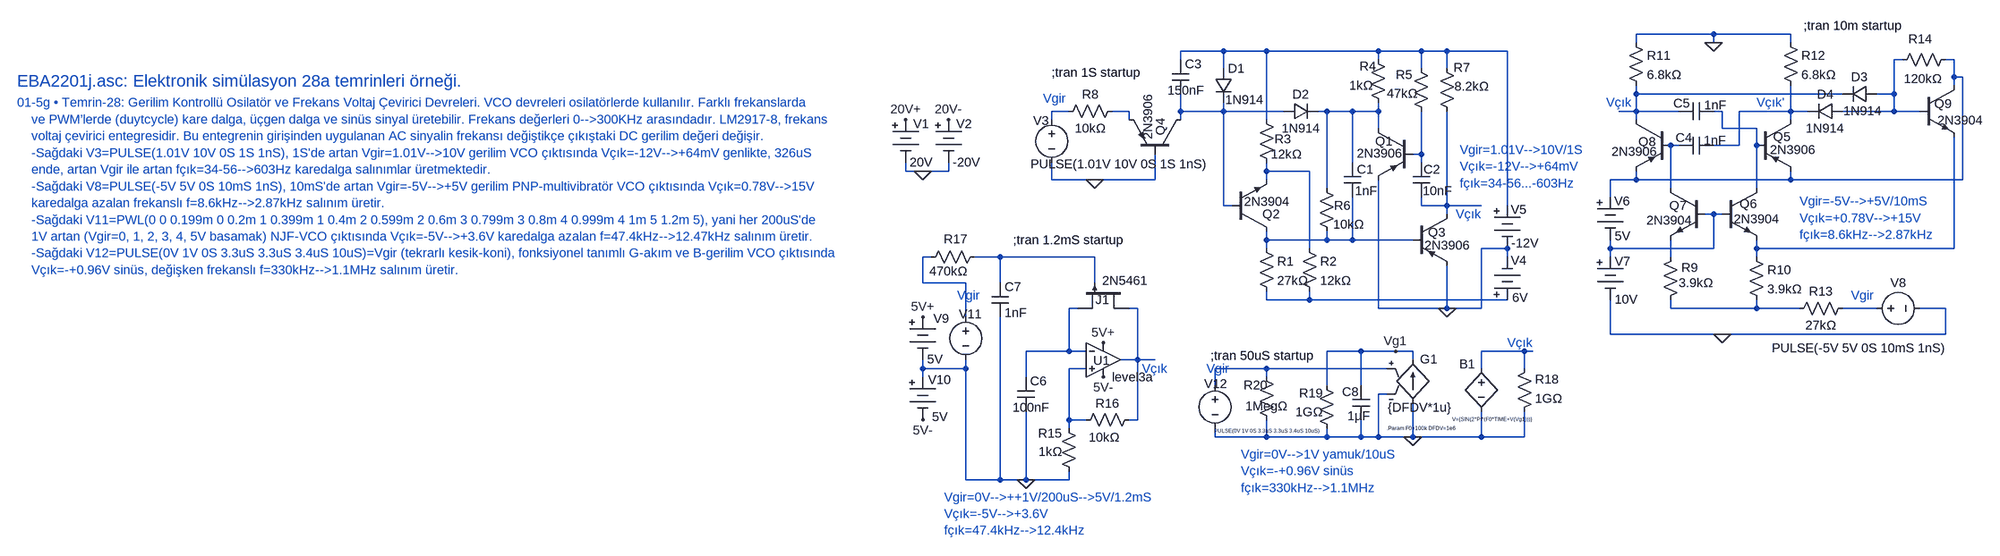
[diagram p0: schematic EBA2201j.asc]
EBA2201j.asc, the LTspice schematic file:
Version 4
SHEET 1 7064 4332
WIRE 3136 -32 2992 -32
WIRE 3280 -32 3136 -32
WIRE 2992 -16 2992 -32
WIRE 3136 -16 3136 -32
WIRE 3280 -16 3280 -32
WIRE 2224 0 2144 0
WIRE 2304 0 2224 0
WIRE 2512 0 2304 0
WIRE 2592 0 2512 0
WIRE 2640 0 2592 0
WIRE 2752 0 2640 0
WIRE 2144 16 2144 0
WIRE 2512 16 2512 0
WIRE 3488 16 3472 16
WIRE 3584 16 3568 16
WIRE 2224 32 2224 0
WIRE 2592 32 2592 0
WIRE 2640 32 2640 0
WIRE 3584 48 3584 16
WIRE 3600 48 3584 48
WIRE 3584 64 3584 48
WIRE 2992 80 2992 64
WIRE 3376 80 2992 80
WIRE 3472 80 3472 16
WIRE 3472 80 3440 80
WIRE 1936 112 1904 112
WIRE 2048 112 2016 112
WIRE 2144 112 2144 80
WIRE 2224 112 2224 96
WIRE 2224 112 2144 112
WIRE 2336 112 2224 112
WIRE 2416 112 2400 112
WIRE 2464 112 2416 112
WIRE 2512 112 2512 96
WIRE 2512 112 2464 112
WIRE 2992 112 2992 80
WIRE 2992 112 2960 112
WIRE 3072 112 2992 112
WIRE 3152 112 3136 112
WIRE 3280 112 3280 64
WIRE 3280 112 3184 112
WIRE 3312 112 3280 112
WIRE 3472 112 3472 80
WIRE 3472 112 3376 112
WIRE 3520 112 3472 112
WIRE 1904 128 1904 112
WIRE 2048 128 2048 112
WIRE 2144 128 2144 112
WIRE 2304 128 2304 0
WIRE 2992 128 2992 112
WIRE 3280 128 3280 112
WIRE 2512 144 2512 112
WIRE 3152 144 3152 112
WIRE 3216 144 3152 144
WIRE 3072 176 3056 176
WIRE 3184 176 3184 112
WIRE 3184 176 3136 176
WIRE 3216 176 3216 144
WIRE 2592 192 2592 112
WIRE 2592 192 2576 192
WIRE 2464 208 2464 112
WIRE 2592 208 2592 192
WIRE 1632 224 1632 208
WIRE 1664 224 1632 224
WIRE 1712 224 1712 208
WIRE 1712 224 1664 224
WIRE 2304 224 2304 208
WIRE 2384 224 2304 224
WIRE 1904 240 1904 208
WIRE 1984 240 1904 240
WIRE 2096 240 2096 192
WIRE 2096 240 1984 240
WIRE 2304 240 2304 224
WIRE 2992 240 2992 224
WIRE 2992 240 2944 240
WIRE 3280 240 3280 224
WIRE 3280 240 2992 240
WIRE 3600 240 3600 48
WIRE 3600 240 3280 240
WIRE 2416 256 2416 112
WIRE 3056 256 3056 176
WIRE 3216 256 3216 176
WIRE 2944 272 2944 240
WIRE 2224 288 2224 112
WIRE 2240 288 2224 288
WIRE 2592 288 2592 272
WIRE 2640 288 2640 112
WIRE 2640 288 2592 288
WIRE 2704 288 2640 288
WIRE 2752 288 2752 0
WIRE 2640 304 2640 288
WIRE 3136 304 3120 304
WIRE 3152 304 3136 304
WIRE 2304 352 2304 336
WIRE 2416 352 2416 336
WIRE 2416 352 2304 352
WIRE 2464 352 2464 272
WIRE 2464 352 2416 352
WIRE 2576 352 2464 352
WIRE 2304 368 2304 352
WIRE 2384 368 2384 224
WIRE 2752 368 2704 368
WIRE 2944 368 2944 352
WIRE 3136 368 3136 304
WIRE 3136 368 2944 368
WIRE 3216 368 3216 352
WIRE 3584 368 3584 160
WIRE 3584 368 3216 368
WIRE 1680 384 1664 384
WIRE 1808 384 1760 384
WIRE 1984 384 1808 384
WIRE 2752 384 2752 368
WIRE 2944 384 2944 368
WIRE 3056 384 3056 352
WIRE 3216 384 3216 368
WIRE 1664 432 1664 384
WIRE 1744 432 1664 432
WIRE 1808 432 1808 384
WIRE 1984 432 1984 384
WIRE 2304 464 2304 448
WIRE 2384 464 2384 448
WIRE 2384 464 2304 464
WIRE 2752 464 2384 464
WIRE 1952 480 1936 480
WIRE 2064 480 2048 480
WIRE 2512 480 2512 240
WIRE 2640 480 2640 400
WIRE 2640 480 2512 480
WIRE 2704 480 2704 368
WIRE 2704 480 2640 480
WIRE 3056 480 3056 464
WIRE 3216 480 3216 464
WIRE 3216 480 3056 480
WIRE 3296 480 3216 480
WIRE 3440 480 3376 480
WIRE 3568 480 3520 480
WIRE 1744 496 1744 432
WIRE 2944 528 2944 464
WIRE 3152 528 2944 528
WIRE 3568 528 3568 480
WIRE 3568 528 3152 528
WIRE 1936 560 1936 480
WIRE 1936 560 1856 560
WIRE 1968 560 1936 560
WIRE 2480 560 2416 560
WIRE 2544 560 2480 560
WIRE 2576 560 2544 560
WIRE 2784 560 2704 560
WIRE 2800 560 2784 560
WIRE 2064 576 2064 480
WIRE 2064 576 2032 576
WIRE 2096 576 2064 576
WIRE 2576 576 2576 560
WIRE 1664 592 1664 576
WIRE 1744 592 1744 576
WIRE 1744 592 1664 592
WIRE 1968 592 1936 592
WIRE 2304 592 2208 592
WIRE 2528 592 2304 592
WIRE 2704 592 2704 560
WIRE 2784 592 2784 560
WIRE 1664 608 1664 592
WIRE 1856 608 1856 560
WIRE 2304 608 2304 592
WIRE 2208 624 2208 592
WIRE 2416 624 2416 560
WIRE 2480 624 2480 560
WIRE 2528 640 2512 640
WIRE 1936 688 1936 592
WIRE 1968 688 1936 688
WIRE 2064 688 2064 576
WIRE 2064 688 2048 688
WIRE 1936 704 1936 688
WIRE 2208 720 2208 704
WIRE 2304 720 2304 688
WIRE 2304 720 2208 720
WIRE 2416 720 2416 704
WIRE 2416 720 2304 720
WIRE 2480 720 2480 688
WIRE 2480 720 2416 720
WIRE 2512 720 2512 640
WIRE 2512 720 2480 720
WIRE 2576 720 2576 656
WIRE 2576 720 2512 720
WIRE 2704 720 2704 672
WIRE 2704 720 2576 720
WIRE 2784 720 2784 672
WIRE 2784 720 2704 720
WIRE 1744 800 1744 592
WIRE 1808 800 1808 496
WIRE 1808 800 1744 800
WIRE 1856 800 1856 672
WIRE 1856 800 1808 800
WIRE 1936 800 1936 784
WIRE 1936 800 1856 800
FLAG 1664 224 0
FLAG 1632 128 20V+
FLAG 1712 128 20V-
FLAG 2640 480 0
FLAG 1984 240 0
FLAG 3136 -16 0
FLAG 3152 528 0
FLAG 1856 800 0
FLAG 2000 544 5V+
FLAG 2000 608 5V-
FLAG 1664 496 5V+
FLAG 1664 688 5V-
FLAG 2576 720 0
FLAG 2544 560 Vg1
SYMBOL Misc\\battery 1632 112 R0
WINDOW 3 8 95 Left 2
WINDOW 0 14 24 Left 2
SYMATTR Value 20V
SYMATTR InstName V1
SYMBOL Misc\\battery 1712 112 R0
WINDOW 3 8 95 Left 2
WINDOW 0 14 24 Left 2
SYMATTR Value -20V
SYMATTR InstName V2
SYMBOL res 2288 352 R0
SYMATTR InstName R1
SYMATTR Value 27kΩ
SYMBOL res 2368 352 R0
SYMATTR InstName R2
SYMATTR Value 12kΩ
SYMBOL res 2288 112 R0
WINDOW 0 31 52 Left 2
WINDOW 3 24 80 Left 2
SYMATTR InstName R3
SYMATTR Value 12kΩ
SYMBOL res 2496 0 R0
WINDOW 0 -19 28 Left 2
WINDOW 3 -38 64 Left 2
SYMATTR InstName R4
SYMATTR Value 1kΩ
SYMBOL res 2576 16 R0
WINDOW 0 -31 28 Left 2
WINDOW 3 -48 63 Left 2
SYMATTR InstName R5
SYMATTR Value 47kΩ
SYMBOL res 2400 240 R0
WINDOW 0 30 48 Left 2
WINDOW 3 28 83 Left 2
SYMATTR InstName R6
SYMATTR Value 10kΩ
SYMBOL cap 2448 208 R0
WINDOW 3 21 53 Left 2
WINDOW 0 24 13 Left 2
SYMATTR Value 1nF
SYMATTR InstName C1
SYMBOL res 2624 16 R0
WINDOW 0 28 15 Left 2
WINDOW 3 30 50 Left 2
SYMATTR InstName R7
SYMATTR Value 8.2kΩ
SYMBOL cap 2576 208 R0
WINDOW 0 20 13 Left 2
WINDOW 3 19 53 Left 2
SYMATTR InstName C2
SYMATTR Value 10nF
SYMBOL cap 2128 16 R0
WINDOW 3 -8 57 Left 2
SYMATTR Value 150nF
SYMATTR InstName C3
SYMBOL res 2032 96 R90
WINDOW 0 0 56 VBottom 2
WINDOW 3 32 56 VTop 2
SYMATTR InstName R8
SYMATTR Value 10kΩ
SYMBOL voltage 1904 112 R0
WINDOW 0 -34 18 Left 2
WINDOW 3 -39 99 Left 2
WINDOW 123 0 0 Left 0
WINDOW 39 0 0 Left 0
SYMATTR InstName V3
SYMATTR Value PULSE(1.01V 10V 0S 1S 1nS)
SYMBOL diode 2208 32 R0
WINDOW 3 19 59 Left 2
SYMATTR Value 1N914
SYMATTR InstName D1
SYMBOL pnp 2144 192 M270
WINDOW 0 34 37 Left 2
WINDOW 3 27 60 Left 2
SYMATTR InstName Q4
SYMATTR Value 2N3906
SYMBOL pnp 2576 144 M0
WINDOW 0 37 24 Left 2
WINDOW 3 19 47 Left 2
SYMATTR InstName Q1
SYMATTR Value 2N3906
SYMBOL pnp 2576 304 R0
WINDOW 0 29 34 Left 2
WINDOW 3 22 58 Left 2
SYMATTR InstName Q3
SYMATTR Value 2N3906
SYMBOL npn 2240 336 M180
WINDOW 3 22 55 Left 2
SYMATTR Value 2N3904
SYMATTR InstName Q2
SYMBOL diode 2336 96 M90
WINDOW 3 32 32 VTop 2
WINDOW 0 0 32 VBottom 2
SYMATTR Value 1N914
SYMATTR InstName D2
SYMBOL Misc\\battery 2752 272 R0
WINDOW 3 8 86 Left 2
WINDOW 0 7 24 Left 2
SYMATTR Value -12V
SYMATTR InstName V5
SYMBOL Misc\\battery 2752 480 M180
WINDOW 3 9 20 Left 2
WINDOW 0 7 89 Left 2
SYMATTR Value 6V
SYMATTR InstName V4
SYMBOL pnp2 3216 128 R0
WINDOW 0 31 32 Left 2
WINDOW 3 25 56 Left 2
SYMATTR InstName Q5
SYMATTR Value 2N3906
SYMBOL npn2 3152 256 R0
WINDOW 0 33 29 Left 2
WINDOW 3 22 57 Left 2
SYMATTR InstName Q6
SYMATTR Value 2N3904
SYMBOL npn2 3120 256 M0
WINDOW 0 34 32 Left 2
WINDOW 3 24 60 Left 2
SYMATTR InstName Q7
SYMATTR Value 2N3904
SYMBOL pnp2 3056 128 M0
WINDOW 0 27 41 Left 2
WINDOW 3 25 59 Left 2
SYMATTR InstName Q8
SYMATTR Value 2N3906
SYMBOL res 3072 368 M0
WINDOW 0 -35 36 Left 2
WINDOW 3 -64 64 Left 2
SYMATTR InstName R9
SYMATTR Value 3.9kΩ
SYMBOL res 3200 368 R0
SYMATTR InstName R10
SYMATTR Value 3.9kΩ
SYMBOL res 2976 -32 R0
SYMATTR InstName R11
SYMATTR Value 6.8kΩ
SYMBOL res 3264 -32 R0
SYMATTR InstName R12
SYMATTR Value 6.8kΩ
SYMBOL cap 3136 160 R90
WINDOW 0 17 55 VBottom 2
WINDOW 3 -9 -3 VTop 2
SYMATTR InstName C4
SYMATTR Value 1nF
SYMBOL cap 3136 96 R90
WINDOW 0 17 59 VBottom 2
WINDOW 3 -11 -4 VTop 2
SYMATTR InstName C5
SYMATTR Value 1nF
SYMBOL res 3392 464 R90
WINDOW 0 0 56 VBottom 2
WINDOW 3 32 56 VTop 2
SYMATTR InstName R13
SYMATTR Value 27kΩ
SYMBOL npn2 3520 64 R0
WINDOW 0 27 34 Left 2
WINDOW 3 33 65 Left 2
SYMATTR InstName Q9
SYMATTR Value 2N3904
SYMBOL res 3584 0 R90
WINDOW 0 -7 63 VBottom 2
WINDOW 3 36 58 VTop 2
SYMATTR InstName R14
SYMATTR Value 120kΩ
SYMBOL voltage 3424 480 M90
WINDOW 0 -32 56 VBottom 2
WINDOW 3 58 -18 VTop 2
WINDOW 123 0 0 Left 0
WINDOW 39 0 0 Left 0
SYMATTR InstName V8
SYMATTR Value PULSE(-5V 5V 0S 10mS 1nS)
SYMBOL Misc\\battery 2944 256 R0
WINDOW 3 8 89 Left 2
WINDOW 0 7 24 Left 2
SYMATTR Value 5V
SYMATTR InstName V6
SYMBOL Misc\\battery 2944 368 R0
WINDOW 3 8 95 Left 2
WINDOW 0 8 24 Left 2
SYMATTR Value 10V
SYMATTR InstName V7
SYMBOL diode 3440 64 R90
WINDOW 3 32 26 VTop 2
WINDOW 0 0 32 VBottom 2
SYMATTR Value 1N914
SYMATTR InstName D3
SYMBOL diode 3376 96 R90
WINDOW 3 32 32 VTop 2
WINDOW 0 0 32 VBottom 2
SYMATTR Value 1N914
SYMATTR InstName D4
SYMBOL pjf 2048 432 R90
WINDOW 0 32 37 VRight 2
WINDOW 3 -4 -35 VRight 2
SYMATTR InstName J1
SYMATTR Value 2N5461
SYMBOL res 1920 688 R0
WINDOW 0 -41 25 Left 2
WINDOW 3 -40 59 Left 2
SYMATTR InstName R15
SYMATTR Value 1kΩ
SYMATTR SpiceLine tol=1 pwr=0.1
SYMBOL res 2064 672 R90
WINDOW 0 1 56 VBottom 2
WINDOW 3 33 62 VTop 2
SYMATTR InstName R16
SYMATTR Value 10kΩ
SYMATTR SpiceLine tol=1 pwr=0.1
SYMBOL cap 1840 608 R0
WINDOW 3 -9 57 Left 2
SYMATTR Value 100nF
SYMATTR InstName C6
SYMBOL cap 1792 432 R0
SYMATTR InstName C7
SYMATTR Value 1nF
SYMBOL voltage 1744 480 R0
WINDOW 0 -13 11 Left 2
WINDOW 3 -13 39 Invisible 2
WINDOW 123 0 0 Left 0
WINDOW 39 0 0 Left 0
SYMATTR InstName V11
SYMATTR Value PWL(0 0 0.199m 0 0.2m 1 0.399m 1 0.4m 2 0.599m 2 0.6m 3 0.799m 3 0.8m 4 0.999m 4 1m 5 1.2m 5)
SYMBOL res 1776 368 R90
WINDOW 0 -17 29 VRight 2
WINDOW 3 43 28 VRight 2
SYMATTR InstName R17
SYMATTR Value 470kΩ
SYMATTR SpiceLine tol=1 pwr=0.1
SYMBOL OpAmps\\UniversalOpAmp3 2000 576 R0
WINDOW 0 -19 1 Left 2
SYMATTR InstName U1
SYMBOL Misc\\battery 1664 480 R0
WINDOW 3 8 95 Left 2
WINDOW 0 20 19 Left 2
SYMATTR Value 5V
SYMATTR InstName V9
SYMBOL Misc\\battery 1664 592 R0
WINDOW 3 17 90 Left 2
WINDOW 0 10 21 Left 2
SYMATTR Value 5V
SYMATTR InstName V10
SYMBOL voltage 2208 608 R0
WINDOW 0 -20 13 Left 2
WINDOW 3 193 101 Right 0
WINDOW 123 0 0 Left 0
WINDOW 39 0 0 Left 0
SYMATTR InstName V12
SYMATTR Value PULSE(0V 1V 0S 3.3uS 3.3uS 3.4uS 10uS)
SYMBOL g 2576 560 R0
WINDOW 0 14 15 Left 2
WINDOW 3 -46 105 Left 2
SYMATTR InstName G1
SYMATTR Value {DFDV*1u}
SYMBOL bv 2704 576 R0
WINDOW 0 -41 8 Left 2
WINDOW 3 -54 111 Left 0
SYMATTR InstName B1
SYMATTR Value V={SIN(2*PI*(F0*TIME+V(Vg1)))}
SYMBOL res 2768 688 M180
WINDOW 0 36 76 Left 2
WINDOW 3 36 40 Left 2
SYMATTR InstName R18
SYMATTR Value 1GΩ
SYMATTR SpiceLine tol=1 pwr=0.1
SYMBOL cap 2464 624 R0
WINDOW 0 -19 12 Left 2
WINDOW 3 -9 57 Left 2
SYMATTR InstName C8
SYMATTR Value 1µF
SYMBOL res 2432 720 R180
WINDOW 0 23 82 Left 2
WINDOW 3 23 47 Left 2
SYMATTR InstName R19
SYMATTR Value 1GΩ
SYMATTR SpiceLine tol=1 pwr=0.1
SYMBOL res 2320 704 R180
WINDOW 0 14 81 Left 2
WINDOW 3 -24 42 Left 2
SYMATTR InstName R20
SYMATTR Value 1MegΩ
SYMATTR SpiceLine tol=1 pwr=0.1
TEXT -232 56 Left 3 ;EBA2201j.asc: Elektronik simülasyon 28a temrinleri örneği.
TEXT -232 96 Left 2 ;01-5g • Temrin-28: Gerilim Kontrollü Osilatör ve Frekans Voltaj Çevirici Devreleri. VCO devreleri osilatörlerde kullanılır. Farklı frekanslarda \n    ve PWM’lerde (duytcycle) kare dalga, üçgen dalga ve sinüs sinyal üretebilir. Frekans değerleri 0-->300KHz arasındadır. LM2917-8, frekans \n    voltaj çevirici entegresidir. Bu entegrenin girişinden uygulanan AC sinyalin frekansı değiştikçe çıkıştaki DC gerilim değeri değişir.\n    -Sağdaki V3=PULSE(1.01V 10V 0S 1S 1nS), 1S'de artan Vgir=1.01V-->10V gerilim VCO çıktısında Vçık=-12V-->+64mV genlikte, 326uS \n    ende, artan Vgir ile artan fçık=34-56-->603Hz karedalga salınımlar üretmektedir.\n    -Sağdaki V8=PULSE(-5V 5V 0S 10mS 1nS), 10mS'de artan Vgir=-5V-->+5V gerilim PNP-multivibratör VCO çıktısında Vçık=0.78V-->15V \n    karedalga azalan frekanslı f=8.6kHz-->2.87kHz salınım üretir.\n    -Sağdaki V11=PWL(0 0 0.199m 0 0.2m 1 0.399m 1 0.4m 2 0.599m 2 0.6m 3 0.799m 3 0.8m 4 0.999m 4 1m 5 1.2m 5), yani her 200uS'de\n    1V artan (Vgir=0, 1, 2, 3, 4, 5V basamak) NJF-VCO çıktısında Vçık=-5V-->+3.6V karedalga azalan f=47.4kHz-->12.47kHz salınım üretir.\n    -Sağdaki V12=PULSE(0V 1V 0S 3.3uS 3.3uS 3.4uS 10uS)=Vgir (tekrarlı kesik-koni), fonksiyonel tanımlı G-akım ve B-gerilim VCO çıktısında \n    Vçık=-+0.96V sinüs, değişken frekanslı f=330kHz-->1.1MHz salınım üretir.
TEXT 1904 40 Left 2 !;tran 1S startup
TEXT 1888 88 Left 2 ;Vgir
TEXT 2656 304 Left 2 ;Vçık
TEXT 2664 184 Left 2 ;Vgir=1.01V-->10V/1S\nVçık=-12V-->+64mV\nfçık=34-56...-603Hz
TEXT 3304 -48 Left 2 !;tran 10m startup
TEXT 2936 96 Left 2 ;Vçık
TEXT 3216 96 Left 2 ;Vçık'
TEXT 3392 456 Left 2 ;Vgir
TEXT 3296 280 Left 2 ;Vgir=-5V-->+5V/10mS\nVçık=+0.78V-->+15V\nfçık=8.6kHz-->2.87kHz
TEXT 1832 352 Left 2 !;tran 1.2mS startup
TEXT 1728 456 Left 2 ;Vgir
TEXT 2072 592 Left 2 ;Vçık
TEXT 1704 832 Left 2 ;Vgir=0V-->++1V/200uS-->5V/1.2mS\nVçık=-5V-->+3.6V\nfçık=47.4kHz-->12.4kHz
TEXT 2528 704 Left 0 !.Param F0=100k DFDV=1e6
TEXT 2200 568 Left 2 !;tran 50uS startup
TEXT 2192 592 Left 2 ;Vgir
TEXT 2752 544 Left 2 ;Vçık
TEXT 2256 752 Left 2 ;Vgir=0V-->1V yamuk/10uS\nVçık=-+0.96V sinüs\nfçık=330kHz-->1.1MHz

The netlist it stands for:
* EBA2201j.asc
V1 20V+ 0 20V
V2 20V- 0 -20V
R1 N016 N021 27kΩ
R2 N013 N021 12kΩ
R3 N001 N013 12kΩ
R4 N001 N008 1kΩ
R5 N001 N012 47kΩ
R6 N008 N016 10kΩ
C1 N008 N016 1nF
R7 N001 N014 8.2kΩ
C2 N012 N014 10nF
C3 N001 N007 150nF
R8 N006 N005 10kΩ
V3 N005 0 PULSE(1.01V 10V 0S 1S 1nS)
D1 N001 N007 1N914
Q4 N007 0 N006 0 2N3906
Q1 N008 N012 0 0 2N3906
Q3 N014 N016 0 0 2N3906
Q2 N016 N007 N013 0 2N3904
D2 N007 N008 1N914
V5 N001 0 -12V
V4 N021 0 6V
Q5 N010 N009 N003 0 2N3906
Q6 N009 N015 N017 0 2N3904
Q7 N011 N015 N020 0 2N3904
Q8 N004 N011 N003 0 2N3906
R9 N020 N024 3.9kΩ
R10 N017 N024 3.9kΩ
R11 0 N004 6.8kΩ
R12 0 N010 6.8kΩ
C4 N010 N011 1nF
C5 N009 N004 1nF
R13 N025 N024 27kΩ
Q9 N003 N002 N017 0 2N3904
R14 N003 N002 120kΩ
V8 N025 0 PULSE(-5V 5V 0S 10mS 1nS)
V6 N003 N015 5V
V7 N015 0 10V
D3 N002 N004 1N914
D4 N002 N010 1N914
J1 N023 N019 N022 2N5461
R15 N027 0 1kΩ tol=1 pwr=0.1
R16 N023 N027 10kΩ tol=1 pwr=0.1
C6 N022 0 100nF
C7 N019 0 1nF
V11 N018 0 PWL(0 0 0.199m 0 0.2m 1 0.399m 1 0.4m 2 0.599m 2 0.6m 3 0.799m 3 0.8m 4 0.999m 4 1m 5 1.2m 5)
R17 N019 N018 470kΩ tol=1 pwr=0.1
XU1 N027 N022 5V+ 5V- N023 level3a  ; pins In+ In- V+ V- OUT
V9 5V+ 0 5V
V10 0 5V- 5V
V12 N028 0 PULSE(0V 1V 0S 3.3uS 3.3uS 3.4uS 10uS)
G1 0 Vg1 N028 0 {DFDV*1u}
B1 N026 0 V={SIN(2*PI*(F0*TIME+V(Vg1)))}
R18 0 N026 1GΩ tol=1 pwr=0.1
C8 Vg1 0 1µF
R19 0 Vg1 1GΩ tol=1 pwr=0.1
R20 0 N028 1MegΩ tol=1 pwr=0.1
.model D D
.lib standard.dio
.model NPN NPN
.model PNP PNP
.lib standard.bjt
.model NJF NJF
.model PJF PJF
.lib standard.jft
* EBA2201j.asc: Elektronik simülasyon 28a temrinleri örneği.
* 01-5g • Temrin-28: Gerilim Kontrollü Osilatör ve Frekans Voltaj Çevirici Devreleri. VCO devreleri osilatörlerde kullanılır. Farklı frekanslarda
*     ve PWM’lerde (duytcycle) kare dalga, üçgen dalga ve sinüs sinyal üretebilir. Frekans değerleri 0-->300KHz arasındadır. LM2917-8, frekans
*     voltaj çevirici entegresidir. Bu entegrenin girişinden uygulanan AC sinyalin frekansı değiştikçe çıkıştaki DC gerilim değeri değişir.
*     -Sağdaki V3=PULSE(1.01V 10V 0S 1S 1nS), 1S'de artan Vgir=1.01V-->10V gerilim VCO çıktısında Vçık=-12V-->+64mV genlikte, 326uS
*     ende, artan Vgir ile artan fçık=34-56-->603Hz karedalga salınımlar üretmektedir.
*     -Sağdaki V8=PULSE(-5V 5V 0S 10mS 1nS), 10mS'de artan Vgir=-5V-->+5V gerilim PNP-multivibratör VCO çıktısında Vçık=0.78V-->15V
*     karedalga azalan frekanslı f=8.6kHz-->2.87kHz salınım üretir.
*     -Sağdaki V11=PWL(0 0 0.199m 0 0.2m 1 0.399m 1 0.4m 2 0.599m 2 0.6m 3 0.799m 3 0.8m 4 0.999m 4 1m 5 1.2m 5), yani her 200uS'de
*     1V artan (Vgir=0, 1, 2, 3, 4, 5V basamak) NJF-VCO çıktısında Vçık=-5V-->+3.6V karedalga azalan f=47.4kHz-->12.47kHz salınım üretir.
*     -Sağdaki V12=PULSE(0V 1V 0S 3.3uS 3.3uS 3.4uS 10uS)=Vgir (tekrarlı kesik-koni), fonksiyonel tanımlı G-akım ve B-gerilim VCO çıktısında
*     Vçık=-+0.96V sinüs, değişken frekanslı f=330kHz-->1.1MHz salınım üretir.
;tran 1S startup
* Vgir
* Vçık
* Vgir=1.01V-->10V/1S
* Vçık=-12V-->+64mV
* fçık=34-56...-603Hz
;tran 10m startup
* Vçık
* Vçık'
* Vgir
* Vgir=-5V-->+5V/10mS
* Vçık=+0.78V-->+15V
* fçık=8.6kHz-->2.87kHz
;tran 1.2mS startup
* Vgir
* Vçık
* Vgir=0V-->++1V/200uS-->5V/1.2mS
* Vçık=-5V-->+3.6V
* fçık=47.4kHz-->12.4kHz
.Param F0=100k DFDV=1e6
;tran 50uS startup
* Vgir
* Vçık
* Vgir=0V-->1V yamuk/10uS
* Vçık=-+0.96V sinüs
* fçık=330kHz-->1.1MHz
.backanno
.end